# EAGLE design G624X (EAGLE 6.6.0)
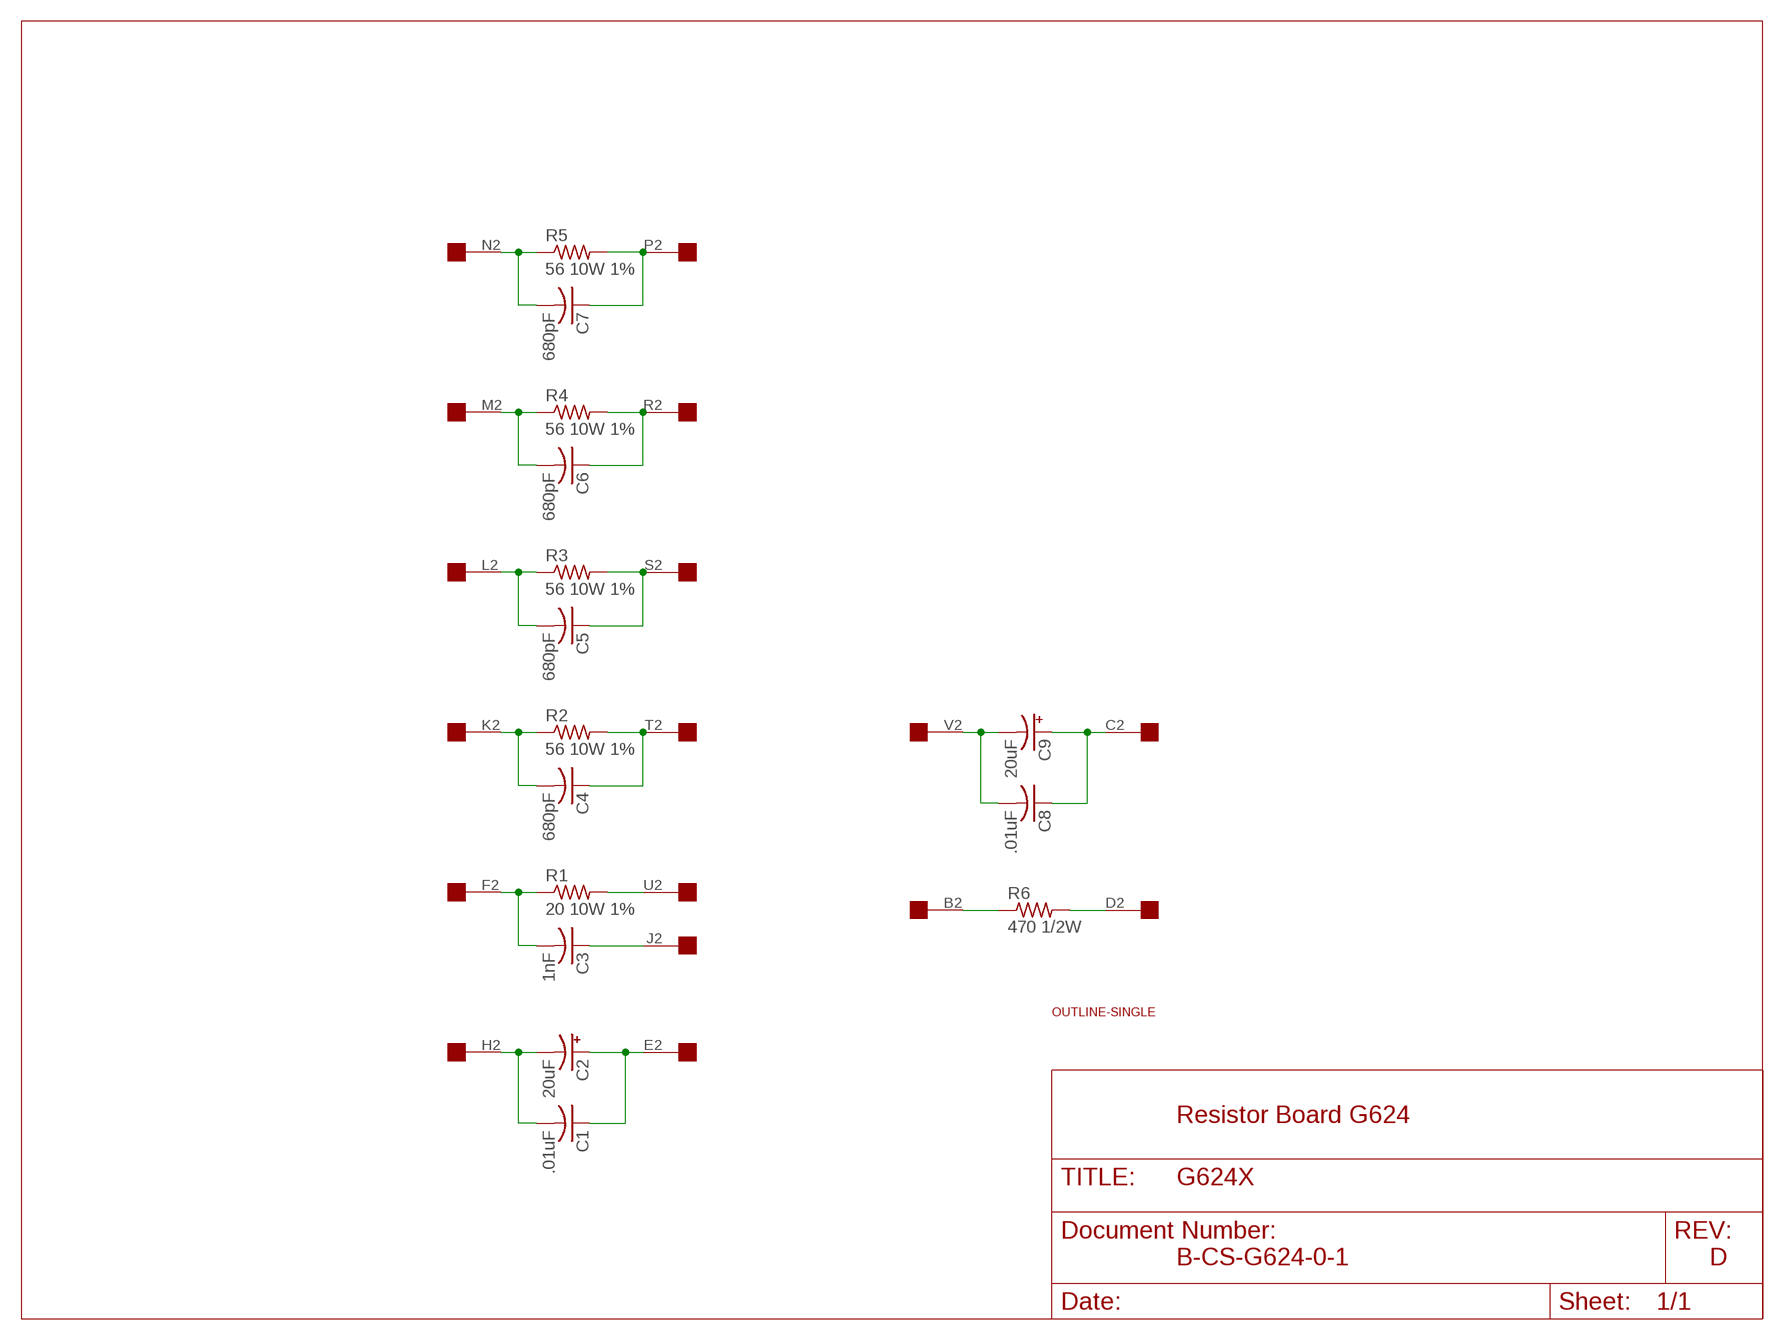
[diagram p0: schematic, sheet 1]

## Parts
C1  .01uF  C-US050-025X075  [C050-025X075]
C2  20uF  CPOL-USE28-8AXIAL  [E28-8]
C3  1nF  C-US050-025X075  [C050-025X075]
C4  680pF  C-US150-054X183  [C150-054X183]
C5  680pF  C-US150-054X183  [C150-054X183]
C6  680pF  C-US050-025X075  [C050-025X075]
C7  680pF  C-US050-025X075  [C050-025X075]
C8  .01uF  C-US050-025X075  [C050-025X075]
C9  20uF  CPOL-USE28-8AXIAL  [E28-8]
R1  20 10W 1%  R-US_0944/51  [0944/51]
R2  56 10W 1%  R-US_0944/51  [0944/51]
R3  56 10W 1%  R-US_0944/51  [0944/51]
R4  56 10W 1%  R-US_0944/51  [0944/51]
R5  56 10W 1%  R-US_0944/51  [0944/51]
R6  470 1/2W  R-US_0411/15  [0411/15]
U$1  EDGE-1  [EDGE-CON1]
U$2  OUTLINE-SINGLE  [SINGLE]

## Nets
N$1: C3.2 R1.1 U$1.F2
N$2: R1.2 U$1.U2
N$3: C8.2 C9.- U$1.V2
N$4: C8.1 C9.+ U$1.C2
N$5: C7.2 R5.1 U$1.N2
N$6: C7.1 R5.2 U$1.P2
N$7: C4.2 R2.1 U$1.K2
N$8: C4.1 R2.2 U$1.T2
N$9: C5.1 R3.2 U$1.S2
N$10: C5.2 R3.1 U$1.L2
N$11: C6.2 R4.1 U$1.M2
N$12: C6.1 R4.2 U$1.R2
N$13: C1.2 C2.- U$1.H2
N$14: C1.1 C2.+ U$1.E2
N$15: R6.1 U$1.B2
N$16: R6.2 U$1.D2
N$17: C3.1 U$1.J2
Unconnected: U$1.A2

## Notes on the sheet
- Resistor Board G624
- B-CS-G624-0-1 | D

## Library data of the parts
C1 C3-C8 = rcl:C-US: CAPACITOR, American symbol
C2 C9 = dec-con:CPOL-USE28-8AXIAL: Large Electrolytic, grin 1.1"
R1-R5 = dec-con:R-US_0944/51: Power Resistor, 2" grid
R6 = rcl:R-US_: RESISTOR, American symbol
U$1 = dec-con:EDGE-1: Single-Sided DEC Edge Connector -- (side 2)
U$2 = dec-con:OUTLINE-*: Board outlines for DEC boards.

## Board
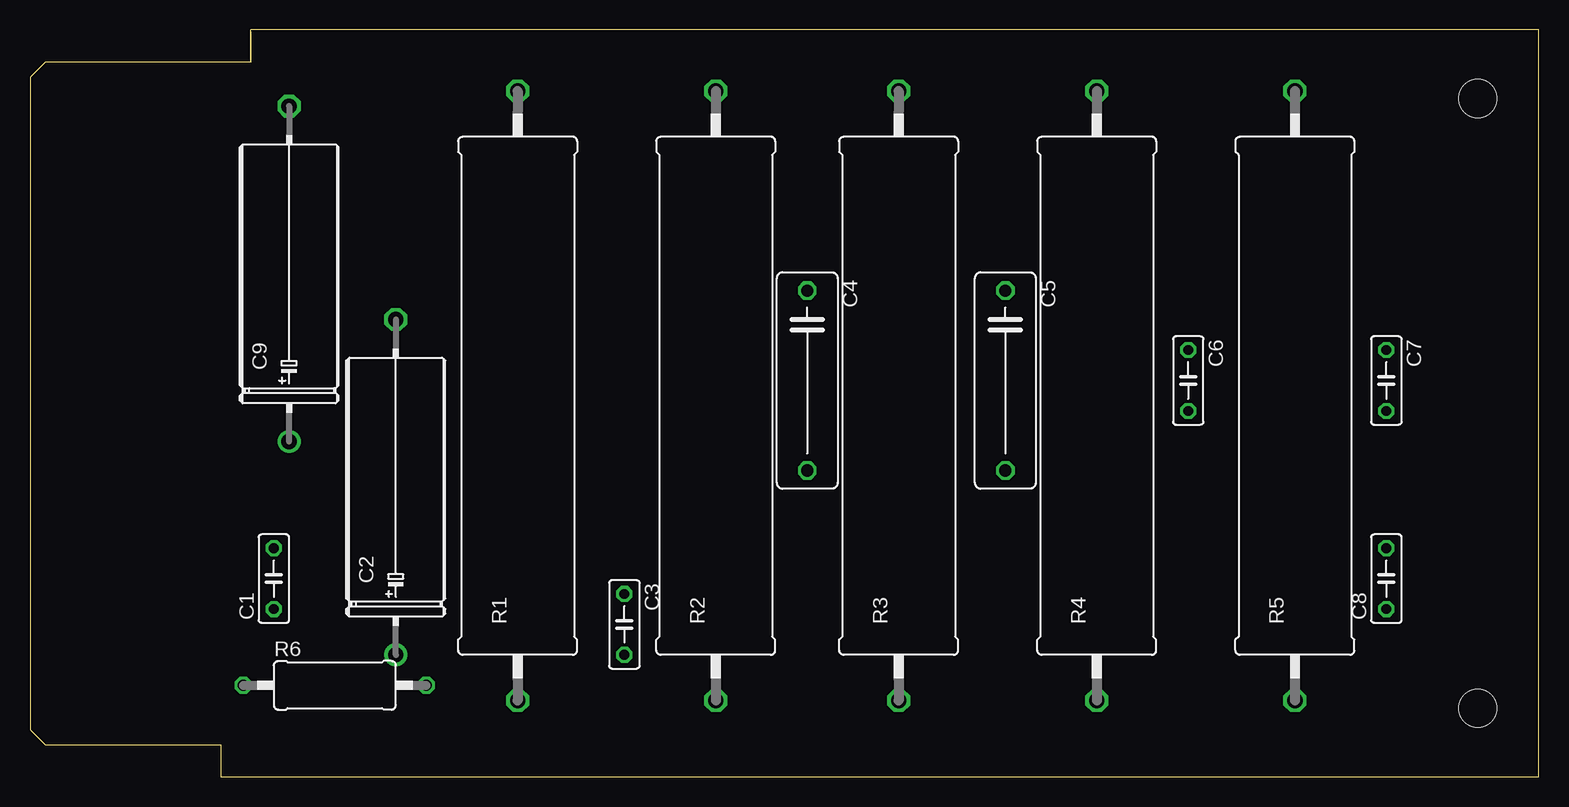
[diagram p1: board, top side]
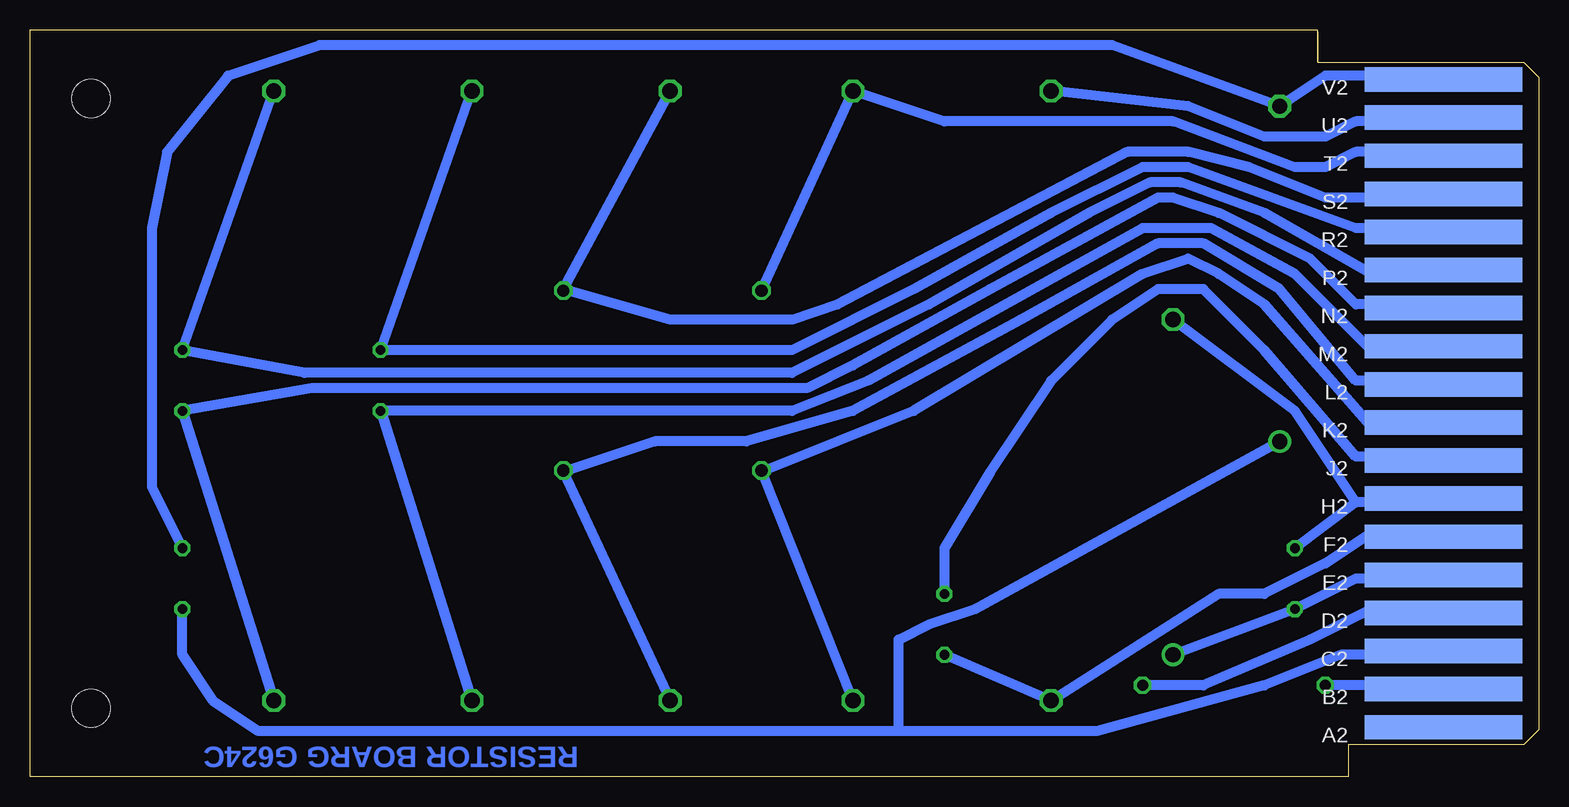
[diagram p2: board, bottom side, seen from below]

Size 125.73 x 62.23 mm. Coordinates in mm from the lower left corner, seen from the top.
Copper layers (1+16): Top 0.035mm / dielectric 1.5mm / Bottom 0.035mm
Design rules "16mils": minimum track width 16mil, minimum drill 32mil, track to track 15mil, track to pad 10mil, pad to pad 10mil, via to via 10mil, smd to smd 10mil, copper to edge 13mil, drill to drill 10mil, minimum pad ring 10mil, minimum via ring 8mil, stop-mask expansion 0mil, vias tented up to drill 0mil, thermal gap 10mil

### Footprints (pad centres in the part's own frame; a part is rotated, then mirrored left to right if it is on the bottom)
C050-025X075 = drill 0.813 octagon: 1 -2.54,0; 2 2.54,0
E28-8 = drill 1.27: + -13.97,0 | drill 1.27 octagon: - 13.97,0
C150-054X183 = drill 1.016 octagon: 1 -7.493,0; 2 7.493,0
0944/51 = drill 1.27 octagon: 1 -25.4,0; 2 25.4,0
0411/15 = drill 0.914 octagon: 1 -7.62,0; 2 7.62,0
EDGE-CON1 = smd 13.106 x 2.032 bottom: A2 7.938,4.128; B2 7.938,7.303; C2 7.938,10.477; D2 7.938,13.652; E2 7.938,16.828; F2 7.938,20.003; H2 7.938,23.177; J2 7.938,26.352; K2 7.938,29.527; L2 7.938,32.703; M2 7.938,35.877; N2 7.938,39.053; P2 7.938,42.227; R2 7.938,45.403; S2 7.938,48.578; T2 7.938,51.752; U2 7.938,54.928; V2 7.938,58.102
SINGLE = hole 3.175: 120.65,56.515; 120.65,5.715

### Placement (x,y rotation side)
C1  20.32,16.51 90 top
C2  30.48,24.13 90 top
C3  49.53,12.7 270 top
C4  64.77,33.02 270 top
C5  81.28,33.02 270 top
C6  96.52,33.02 270 top
C7  113.03,33.02 270 top
C8  113.03,16.51 90 top
C9  21.59,41.91 90 top
R1  40.64,31.75 90 top
R2  57.15,31.75 90 top
R3  72.39,31.75 90 top
R4  88.9,31.75 90 top
R5  105.41,31.75 90 top
R6  25.4,7.62 0 top
U$1  0,0 0 top
U$2  0,0 0 top

### Tracks (layer width: path | path; a pad name or v marks a point on that pad's centre or on a via)
N$1
  Bottom 0.813: U$1.F2 8.89,20.32 13.97,20.32 17.78,17.78 22.86,15.24 26.67,15.24 R1.1 C3.2
N$2
  Bottom 0.813: U$1.U2 8.89,54.61 15.24,54.61 17.78,53.34 22.86,53.34 29.21,55.88 R1.2
N$3
  Bottom 0.813: U$1.V2 8.89,58.42 17.78,58.42 C9.- 35.56,60.96 101.6,60.96 109.22,58.42 114.3,52.07 115.57,45.72 115.57,24.13 C8.2
N$4
  Bottom 0.813: U$1.C2 8.89,10.16 16.51,10.16 22.86,7.62 36.83,3.81 53.34,3.81 | C9.+ 46.99,13.97 50.8,12.7 53.34,11.43 53.34,3.81 | 53.34,3.81 106.68,3.81 110.49,6.35 113.03,10.16 C8.1
N$5
  Bottom 0.813: R5.1 C7.2 102.24,32.38 60.96,32.38 57.15,34.29 45.72,40.64 31.75,48.26 30.48,48.26 26.67,46.99 19.05,43.18 15.24,39.37 8.89,39.37 U$1.N2
N$6
  Bottom 0.813: U$1.P2 8.89,41.91 13.97,41.91 22.86,46.99 29.85,49.53 32.39,49.53 37.47,46.99 50.8,39.37 62.23,33.66 102.87,33.66 C7.1 R5.2
N$7
  Bottom 0.813: U$1.K2 8.89,29.21 13.97,29.21 22.86,39.37 26.67,41.91 29.21,43.18 33.02,41.91 52.07,30.48 64.77,25.4 | 64.77,25.4 R2.1 | 64.77,25.4 C4.2
N$8
  Bottom 0.813: U$1.T2 8.89,52.07 15.24,52.07 17.78,50.8 20.32,50.8 30.48,54.61 49.53,54.61 R2.2 64.77,40.64 C4.1
N$9
  Bottom 0.813: U$1.S2 8.89,48.26 17.78,48.26 24.13,50.8 29.21,52.07 34.29,52.07 58.42,39.37 62.23,38.1 72.39,38.1 81.28,40.64 | 81.28,40.64 R3.2 | 81.28,40.64 C5.1
N$10
  Bottom 0.813: U$1.L2 8.89,33.02 15.24,33.02 21.59,40.64 27.94,44.45 31.75,44.45 43.18,38.1 57.15,30.48 66.04,27.94 73.66,27.94 81.28,25.4 | 81.28,25.4 R3.1 | 81.28,25.4 C5.2
N$11
  Bottom 0.813: U$1.M2 8.89,35.56 13.97,35.56 20.32,41.91 27.31,45.72 33.02,45.72 55.88,33.02 62.23,30.48 C6.2 R4.1
N$12
  Bottom 0.813: U$1.R2 8.89,45.72 15.24,45.72 29.21,50.8 33.02,50.8 40.64,46.99 52.07,40.64 62.23,35.56 C6.1 R4.2
N$13
  Bottom 0.813: U$1.H2 8.89,22.86 15.24,22.86 | 15.24,22.86 20.32,30.48 C2.- | 15.24,22.86 C1.2
N$14
  Bottom 0.813: U$1.E2 8.89,16.51 15.24,16.51 C1.1 C2.+
N$15
  Bottom 0.813: U$1.B2 8.89,7.62 R6.1
N$16
  Bottom 0.813: U$1.D2 8.89,13.97 13.97,13.97 19.05,11.43 27.94,7.62 R6.2
N$17
  Bottom 0.813: U$1.J2 8.89,26.67 15.24,26.67 22.86,35.56 27.94,40.64 31.75,40.64 35.56,38.1 40.64,33.02 45.72,25.4 49.53,19.05 C3.1

### Text on the board
Bottom: RESISTOR BOARG G624C